# Altium schematic sheet 02_power_mppc.SchDoc
size A; SheetNumber: 4; SheetTotal: 17
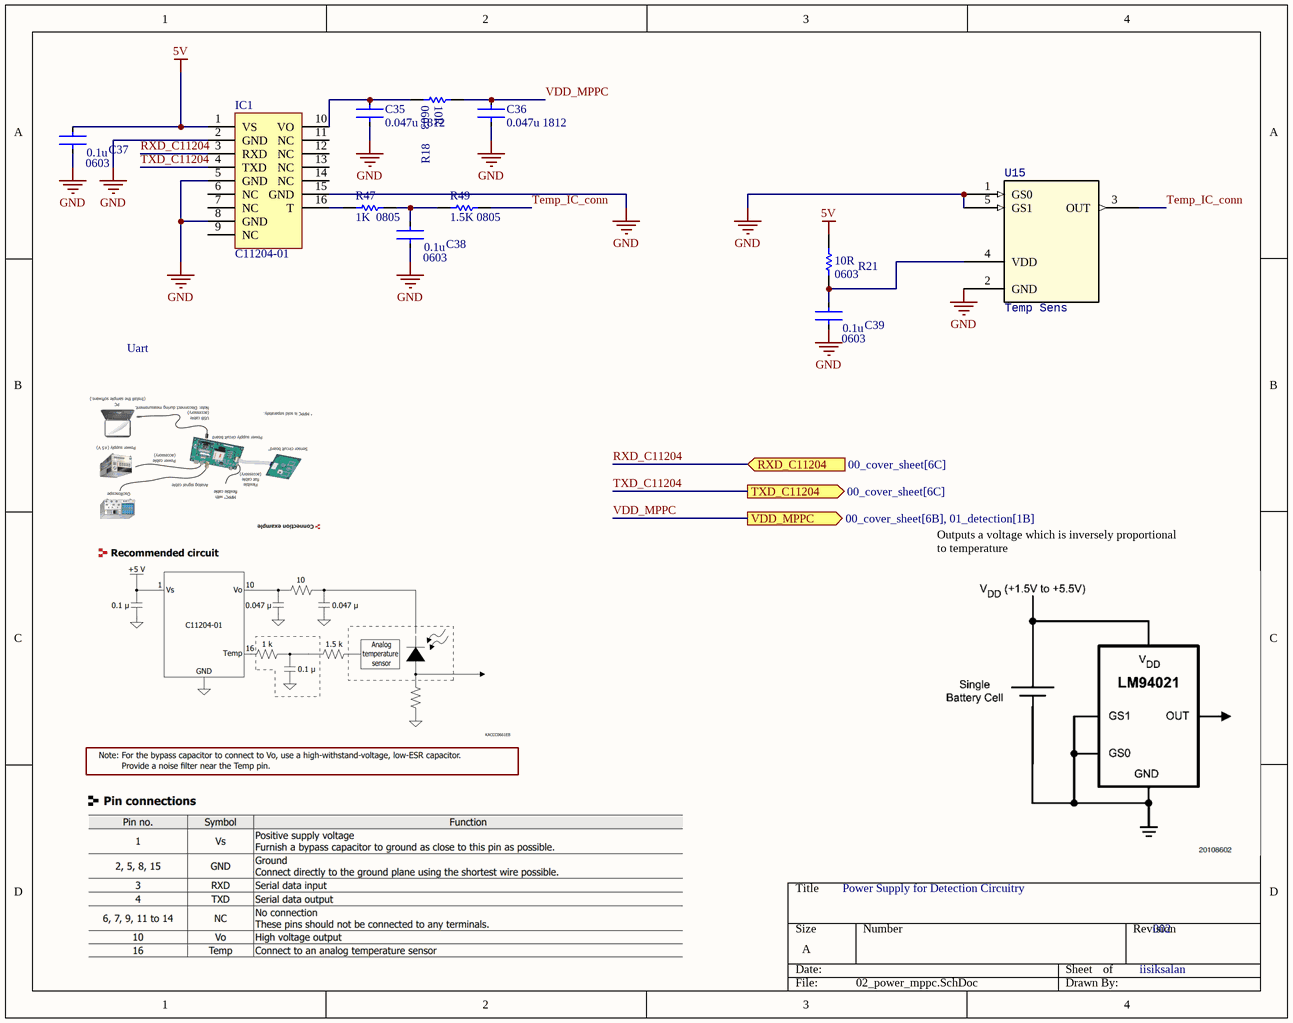
[diagram p0: 02_power_mppc.SchDoc]

## Parts
C35  0.047u 1812  [1812]
C36  0.047u 1812  [1812]
C37  CGA3E2X7R1H104K080AA  [CAPTDK0603]  (value not drawn)
C38  CGA3E2X7R1H104K080AA  [CAPTDK0603]  (value not drawn)
C39  CGA3E2X7R1H104K080AA  [CAPTDK0603]  (value not drawn)
IC1  C11204-01  [MPPC_POWER_C11204-01]
R18  RMCF0603FT10R0  [RES-STACK-POLE-0603]  (value not drawn)
R21  RMCF0603FT10R0  [RES-STACK-POLE-0603]  (value not drawn)
R47  1K  0805  [RES-STACK-POLE-0805]
R49  1.5K 0805  [RES-STACK-POLE-0805]
U15  Temp Sens  [SOT-1.1]

## Ports
RXD_C11204 (in, see 00_cover_sheet[6C]), TXD_C11204 (out, see 00_cover_sheet[6C]), VDD_MPPC (out, see 00_cover_sheet[6B], 01_detection[1B])

## Nets
5V: C37.1 IC1.1(VS) R21.2
GND: C35.2 C36.2 C37.2 C38.2 C39.2 IC1.2(GND) IC1.5(GND) IC1.8(GND) IC1.15(GND) U15.1(GS0) U15.2(GND) U15.5(GS1)
RXD_C11204: IC1.3(RXD) ; port RXD_C11204
Temp_IC_conn: R49.2 U15.3(OUT)
TXD_C11204: IC1.4(TXD) ; port TXD_C11204
VDD_MPPC: C36.1 R18.2 ; port VDD_MPPC
NetC35_1: C35.1 IC1.10(VO) R18.1
NetC38_1: C38.1 R47.2 R49.1
NetC39_1: C39.1 R21.1 U15.4(VDD)
NetIC1_16: IC1.16(T) R47.1

Not connected (* = marked no-connect by the designer): IC1 6(NC) 7(NC) 9(NC) 11(NC) 12(NC) 13(NC) 14(NC)

## Notes on the sheet
- Uart
- Outputs a voltage which is inversely proportional
  to temperature
- Power Supply for Detection Circuitry
- iisiksalan
- 002
- (in symbol CGA3E2X7R1H104K080AA) 0.1u; 0603
- (in symbol RMCF0603FT10R0) 0603; 10R

## Library data of the parts
C35 C36 = C1812C473F1GAC7800: CAP CER 0.047UF 100V C0GNP0 1812; Supplier 1: Digikey; Supplier Part Number 1: 399-C1812C473F1GAC7800CT-ND
C37-C39 = CGA3E2X7R1H104K080AA: CAP CER 0.1UF 50V X7R 0603; Supplier 1: Digi-Key; Supplier Part Number 1: 445-5666-1-ND
IC1 = MPPC-Power: MPPC Hamamutsa Power IC
R18 R21 = RMCF0603FT10R0: RES 10 OHM 1% 1/10W 0603; Supplier 1: Digi-Key; Supplier Part Number 1: RMCF0603FT10R0CT-ND
R47 = RK73H2ATTD1001F: RES 1K OHM 1% 1/4W 0805; Supplier 1: Digikey; Supplier Part Number 1: 2019-RK73H2ATTD1001FCT-ND
R49 = RK73H2ATTD1501F: RES 1.5K OHM 1% 1/4W 0805; Supplier 1: Digikey; Supplier Part Number 1: 2019-RK73H2ATTD1501FCT-ND
U15 = LM94021BIMGX/NOPB: SENSOR ANALOG -50C-150C SC70-5; Supplier 1: Digikey; Supplier Part Number 1: LM94021BIMGX/NOPBCT-ND